# Altium schematic sheet USB.SchDoc
size A4
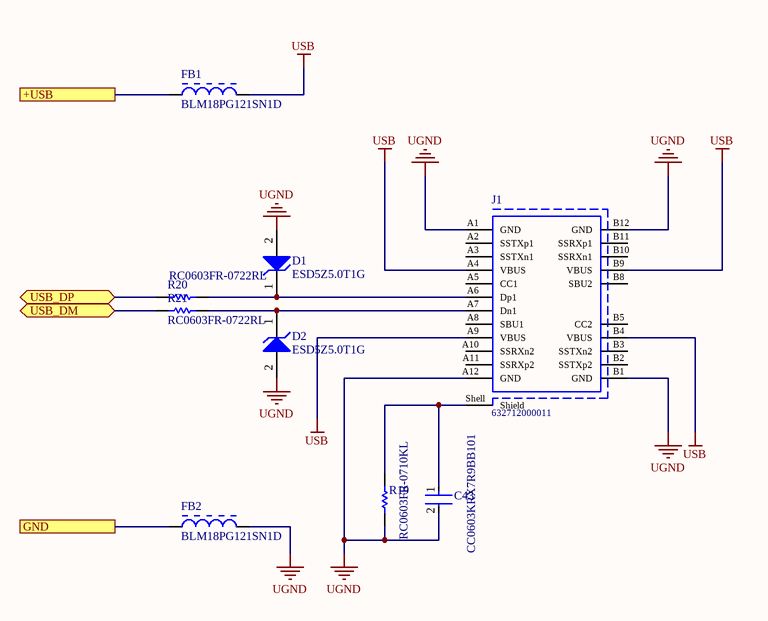
[diagram p0: USB.SchDoc]

## Parts
C43  CC0603KRX7R9BB101  [FP-CC0603-DA-MFG]
D1  ESD5Z5.0T1G  [ONSC-SOD-523-2-502-01_V]
D2  ESD5Z5.0T1G  [ONSC-SOD-523-2-502-01_V]
FB1  BLM18PG121SN1D  [MURA-BLM18PG_KG-B25-CHIP-2_V1]
FB2  BLM18PG121SN1D  [MURA-BLM18PG_KG-B25-CHIP-2_V1]
J1  632712000011  [632712000011]
R19  RC0603FR-0710KL  [RESC1608X55X25ML10T15]
R20  RC0603FR-0722RL  [RESC1608X55X25NL10T15]
R21  RC0603FR-0722RL  [RESC1608X55X25NL10T15]

## Ports
+USB, GND, USB_DM (bidir), USB_DP (bidir)

## Nets
UGND: C43.2 D1.2(A) D2.2(A) FB2.2 J1.A1(GND) J1.A12(GND) J1.B1(GND) J1.B12(GND) R19.2
USB: FB1.2 J1.A4(VBUS) J1.A9(VBUS) J1.B4(VBUS) J1.B9(VBUS)
+USB: FB1.1 ; port +USB
GND: FB2.1 ; port GND
USB_DM: R21.1 ; port USB_DM
USB_DP: R20.1 ; port USB_DP
NetC43_1: C43.1 J1.Shell(Shield) R19.1
NetD1_1: D1.1(K) J1.A6(Dp1) R20.2
NetD2_1: D2.1(K) J1.A7(Dn1) R21.2

Not connected (* = marked no-connect by the designer): J1 A2(SSTXp1) A3(SSTXn1) A5(CC1) A8(SBU1) A10(SSRXn2) A11(SSRXp2) B2(SSTXp2) B3(SSTXn2) B5(CC2) B8(SBU2) B10(SSRXn1) B11(SSRXp1)

## Library data of the parts
C43 = CMP-03422-000747-1: CAP CER 100PF 50V X7R 0603; Manufacturer: YAGEO; Material: Ceramic; Tolerance: 0.1; Temperature Coefficient: 15%; Temperature: -55°C to +125°C; Device Class L3: Ceramic Capacitors; Value: 100 pF; Manufacturer Part Number: CC0603KRX7R9BB101; Temperature Range High: +125°C; Footprint Url: http://www.yageo.com/exep/pages/download/literatures/UPY-C_GEN_24.pdf; Device Class L1: Passive Components; ComponentLink2URL: http://www.yageo.com/documents/recent/UPY-GPHC_X7R_6.3V-to-50V_18.pdf; Octopart: https://octopart.com/cc0603krx7r9bb101-yageo-42334526; RoHS: TRUE; Device Class L2: Capacitors; Mouser Description: Multilayer Ceramic Capacitor, CC Series, 100 pF, - 10%, X7R, 50 V, 0603 [1608 Metric]; Voltage Rating: 50 V; Digikey Description: CAP CER 100PF 50V X7R 0603; Category: Cap; Voltage: 50 V; Package: CC0603-DA; Automotive: No; ComponentLink2Description: Datasheet; Lead Free: Yes; Temperature Range Low: -55°C; Height: 0.9mm; Temperature Characteristic: X7R; Capacitance: 100 pF
D1 D2 = CMP-1063-00102-1: Transient Voltage Suppressor, Micro-Packaged Diode for ESD Protection, 2-Pin SOD-523, Pb-Free, Tape and Reel; Manufacturer: On Semiconductor; V(BR) Min (V): 6.2; VRWM Max (V): 5; Number of Lines: 1; PPK Max (W): 174; IR Max (uA): 0.05; Direction: Unidirectional; PackageVersion: Rev. E, 09/2010; Mounting Technology: Surface Mount; Packing: Tape and Reel; ComponentLink2URL: http://www.onsemi.cn/pub_link/Collateral/ESD5Z2.5T1-D.PDF; ComponentLink2Description: Datasheet; PackageReference: SOD-523-2-502-01; ComponentLink1Description: Manufacturer URL; ComponentLink3URL: http://www.onsemi.com/pub_link/Collateral/502-01.PDF; PackageDescription: 2-Pin SOD, Body 1.2 x 0.8 mm; ComponentLink3Description: Package Specification; ComponentLink1URL: http://www.onsemi.com/; RoHS: Pb-Free; PartNumber: ESD5Z5.0T1G; DatasheetVersion: Rev. 10
FB1 FB2 = CMP-0686-00557-6: Chip Ferrite Bead for Power Lines, 120 Ohm, 2000 mA, -55 to 125 degC, 1.6 x 0.8 x 0.95 mm SMD, Tape and Reel; Manufacturer: Murata; Impedance (at 100 MHz): 120 Ohm +/- 25%; Rated Current: 2000 mA; DC Resistance: 0.05 Ohm Max.; DatasheetVersion: 08/2013; PackageDescription: 2-Pin Chip, Body 1.6 x 0.8 mm; ComponentLink3URL: http://www.murata.com/products/catalog/pdf/c31e.pdf; PartNumber: BLM18PG121SN1D; ComponentLink1URL: http://www.murata.com/; ComponentLink2Description: Datasheet; Mounting Technology: Surface Mount; ComponentLink1Description: Manufacturer URL; PackageReference: BLM18_H950-2; ComponentLink2URL: http://www.murata.com/products/catalog/pdf/c31e.pdf; ComponentLink3Description: Package Specification; Packing: Tape and Reel; Operating Temperature Range: -55 to 125 degC
J1 = CMP-1502-03215-1: USB 3.1 Type C Plug WR-COM, Horizontal, SMT; Manufacturer: Wurth Elektronik; Contact Resistance: 30mOhm; Rated Current: 5A; Working Voltage: 20VDC; Gender: Plug; Part Number: 632712000011; Operating Temperature: -25to105degC; Mounting Technology: SMT; Packaging: TapeandReel; Manufacturer URL: http://www.we-online.de; Datasheet URL: https://katalog.we-online.de/em/datasheet/632712000011.pdf; Connector Type: USB3.1TypeC; Orientation: Horizontal; Publisher: WurthElektronik; Package Reference: 632712000011
R19 = CMP-2100-03664-1: Chip Resistor, 10 KOhm, +/- 1%, 01 W, -55 to 155 degC, 0603 (1608 Metric), RoHS, Tape and Reel; Manufacturer: Yageo; Temperature Coefficient: 100ppm/degreesC; Resistance: 10KOhm; Voltage Rating: 75V; Power Rating: 100mW; Voltage Rating (DC): 50V; Composition: ThickFilm; RoHSCompliant: true; Height: 0.45mm; Lead Free: LeadFree; Case Code (Metric): 1608; Case/Package: 0603; Datasheet Version: Rev. 5, 10/2016; Package Reference: 0603; Depth: 0.8mm; Package Description: 2-Pin Surface Mount Device, Body 1.6 x 0.8 mm; Case Code (Imperial): 0603; Packaging: TapeandReel; Termination: SMD/SMT; Lead Pitch: 0.3mm; Width: 0.8mm; Number of Pins: 2; Length: 1.6mm; REACH SVHC: NoSVHC; Military Standard: Not; Max Operating Temperature: 155degC; Min Operating Temperature: -55degC; Manufacturer URL: http://www.yageo.com/; Datasheet URL: http://www.yageo.com/NewPortal/yageodocoutput?fileName=/pdf/R-Chip/PYu-RC_Group_51_RoHS_L_5.pdf; Weight: 7.1E-05oz; Tolerance: 1%
R20 R21 = CMP-1659-00033-1: Chip Resistor, 22 Ohm, +/- 1%, 0.1 W, -55 to 155 degC, 0603 (1608 Metric), RoHS, Tape and Reel; Max Ouput Current: 8 A; Case\Package: SIP; Max Input Voltage: 1.4 V; ComponentLink2URL: http://www.yageo.com/documents/recent/PYu-RC_Group_51_RoHS_L_04.pdf; RoHSCompliant: true; Max Operating Temperature: 100 degC; PackageDescription: 2-Pin Surface Mount Device, Body 1.6 x 0.8 mm; ComponentLink1Description: Manufacturer URL; ComponentLink1URL: http://www.yageo.com/; Length: 18.5 mm; REACH SVHC: Unknown; Pins: 4; DatasheetVersion: Rev. 4, 02/2016; PackageReference: 0603; Output Current: 8 A; Min Operating Temperature: -25 degC; Height: 19.6 mm; Mount: Through Hole; Radiation Hardening: No; ComponentLink2Description: Datasheet; Package Quantity: 200; Packaging: Rail/Tube